# Altium schematic sheet User Interface.SchDoc: DO NOT FILL THIS IN
size Tabloid; Date: DO NOT FILL THIS IN; ApprovedBy: DO NOT FILL THIS IN; CheckedBy: DO NOT FILL THIS IN; Author: DO NOT FILL THIS IN; CompanyName: DO NOT FILL THIS IN; DrawnBy: DO NOT FILL THIS IN; Engineer: DO NOT FILL THIS IN; Organization: DO NOT FILL THIS IN; Address1: DO NOT FILL THIS IN; Address2: DO NOT FILL THIS IN; Address3: DO NOT FILL THIS IN; Address4: DO NOT FILL THIS IN; DocumentNumber: DO NOT FILL THIS IN; Revision: DO NOT FILL THIS IN; SheetNumber: 2; SheetTotal: 9; PageSetup: Record=PageOptions|CenterHorizontal=True|CenterVertical=True|PrintScale=1.00|XCorrection=1.00|YCorrection=1.00|PrintKind=1|BorderSize=5000000|LeftOffset=0|BottomOffset=0|Orientation=2|PaperLength=1000|PaperWidth=1000|Scale=100|PaperSource=7|PrintQuality=-4|MediaType=1|DitherType=10|PaperKind=Ledger|PrintScaleMode=1; cpr-ItemNumber: 025619; cpr-ItemName1: TurtleBot4 UI board; cpr-ItemName2: Rev 2; cpr-Revision: 2; cpr-SheetNumber: 2; cpr-SheetTotal: 10; cpr-Draft: AG; cpr-DraftDate: 19/04/2022; Time: DO NOT FILL THIS IN; ImagePath: DO NOT FILL THIS IN; Application_BuildNumber: DO NOT FILL THIS IN
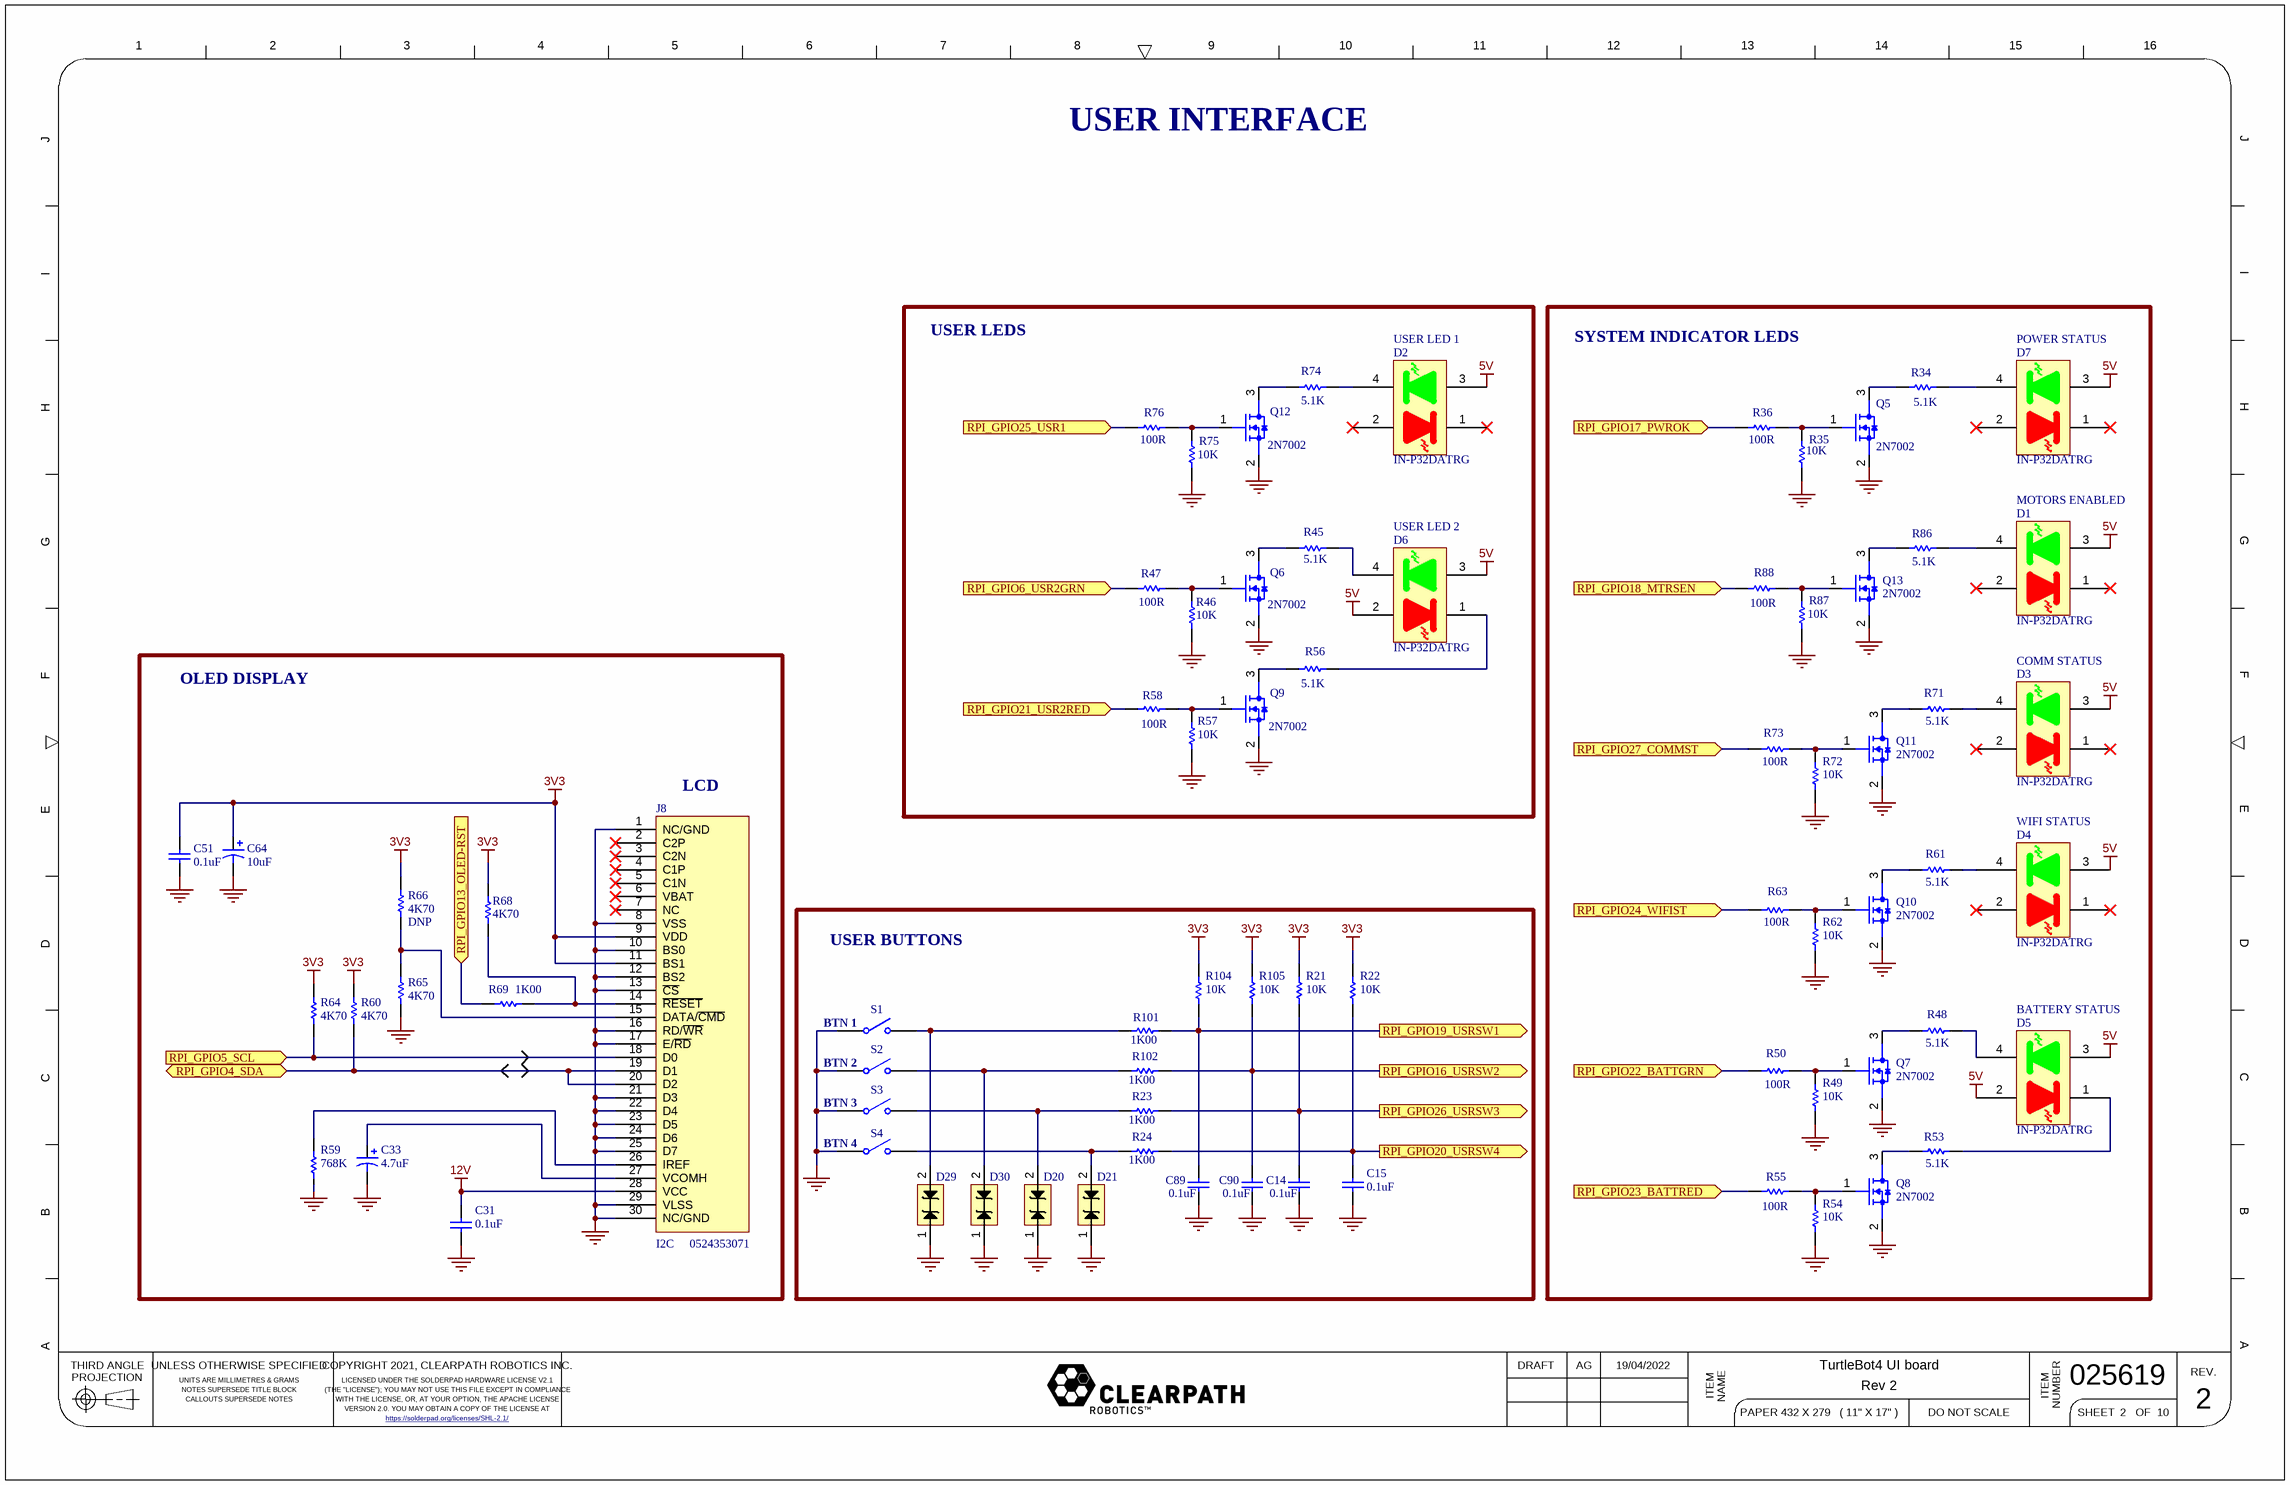
[diagram p0: User Interface.SchDoc]

## Parts
C14  value 0.1uF  [C0805]  (hidden comment: Capacitor _SMT)
C15  value 0.1uF  [C0805]  (hidden comment: Capacitor _SMT)
C31  value 0.1uF  [C0805]  (hidden comment: Capacitor _SMT)
C33  value 4.7uF  [CAP_TANT_3216-18]  (hidden comment: Cap Pol1)
C51  value 0.1uF  [C0805]  (hidden comment: Capacitor _SMT)
C64  value 10uF  [CAP_TANT_3216-18]  (hidden comment: Cap Pol1)
C89  value 0.1uF  [C0805]  (hidden comment: Capacitor _SMT)
C90  value 0.1uF  [C0805]  (hidden comment: Capacitor _SMT)
D1  MOTORS ENABLED  [IN-P32DATRG]
D2  USER LED 1  [IN-P32DATRG]
D3  COMM STATUS  [IN-P32DATRG]
D4  WIFI STATUS  [IN-P32DATRG]
D5  BATTERY STATUS  [IN-P32DATRG]
D6  USER LED 2  [IN-P32DATRG]
D7  POWER STATUS  [IN-P32DATRG]
D20  TVS DIODE BIDIR 15V SMC  [DO-214AA]  (value not drawn)
D21  TVS DIODE BIDIR 15V SMC  [DO-214AA]  (value not drawn)
D29  TVS DIODE BIDIR 15V SMC  [DO-214AA]  (value not drawn)
D30  TVS DIODE BIDIR 15V SMC  [DO-214AA]  (value not drawn)
J8  Mfg PN: 0524353071  [MOLEX_0524353071_REV]  (hidden comment: 128x64 OLED)
Q5  Mfg PN: 2N7002  [SOT-23-3]  (hidden comment: NFET)
Q6  Mfg PN: 2N7002  [SOT-23-3]  (hidden comment: NFET)
Q7  Mfg PN: 2N7002  [SOT-23-3]  (hidden comment: NFET)
Q8  Mfg PN: 2N7002  [SOT-23-3]  (hidden comment: NFET)
Q9  Mfg PN: 2N7002  [SOT-23-3]  (hidden comment: NFET)
Q10  Mfg PN: 2N7002  [SOT-23-3]  (hidden comment: NFET)
Q11  Mfg PN: 2N7002  [SOT-23-3]  (hidden comment: NFET)
Q12  Mfg PN: 2N7002  [SOT-23-3]  (hidden comment: NFET)
Q13  Mfg PN: 2N7002  [SOT-23-3]  (hidden comment: NFET)
R21  value 10K  [R0805]  (hidden comment: Resistor_SMT)
R22  value 10K  [R0805]  (hidden comment: Resistor_SMT)
R23  value 1K00  [R0805]  (hidden comment: Resistor_SMT)
R24  value 1K00  [R0805]  (hidden comment: Resistor_SMT)
R34  value 5.1K  [R0805]  (hidden comment: Resistor_SMT)
R35  value 10K  [R0805]  (hidden comment: Resistor_SMT)
R36  value 100R  [R0805]  (hidden comment: Resistor_SMT)
R45  value 5.1K  [R0805]  (hidden comment: Resistor_SMT)
R46  value 10K  [R0805]  (hidden comment: Resistor_SMT)
R47  value 100R  [R0805]  (hidden comment: Resistor_SMT)
R48  value 5.1K  [R0805]  (hidden comment: Resistor_SMT)
R49  value 10K  [R0805]  (hidden comment: Resistor_SMT)
R50  value 100R  [R0805]  (hidden comment: Resistor_SMT)
R53  value 5.1K  [R0805]  (hidden comment: Resistor_SMT)
R54  value 10K  [R0805]  (hidden comment: Resistor_SMT)
R55  value 100R  [R0805]  (hidden comment: Resistor_SMT)
R56  value 5.1K  [R0805]  (hidden comment: Resistor_SMT)
R57  value 10K  [R0805]  (hidden comment: Resistor_SMT)
R58  value 100R  [R0805]  (hidden comment: Resistor_SMT)
R59  value 768K  [R0805]  (hidden comment: Resistor_SMT)
R60  value 4K70  [R0805]  (hidden comment: Resistor_SMT)
R61  value 5.1K  [R0805]  (hidden comment: Resistor_SMT)
R62  value 10K  [R0805]  (hidden comment: Resistor_SMT)
R63  value 100R  [R0805]  (hidden comment: Resistor_SMT)
R64  value 4K70  [R0805]  (hidden comment: Resistor_SMT)
R65  value 4K70  [R0805]  (hidden comment: Resistor_SMT)
R66  value 4K70  [R0805]  (hidden comment: Resistor_SMT)
R68  value 4K70  [R0805]  (hidden comment: Resistor_SMT)
R69  value 1K00  [R0805]  (hidden comment: Resistor_SMT)
R71  value 5.1K  [R0805]  (hidden comment: Resistor_SMT)
R72  value 10K  [R0805]  (hidden comment: Resistor_SMT)
R73  value 100R  [R0805]  (hidden comment: Resistor_SMT)
R74  value 5.1K  [R0805]  (hidden comment: Resistor_SMT)
R75  value 10K  [R0805]  (hidden comment: Resistor_SMT)
R76  value 100R  [R0805]  (hidden comment: Resistor_SMT)
R86  value 5.1K  [R0805]  (hidden comment: Resistor_SMT)
R87  value 10K  [R0805]  (hidden comment: Resistor_SMT)
R88  value 100R  [R0805]  (hidden comment: Resistor_SMT)
R101  value 1K00  [R0805]  (hidden comment: Resistor_SMT)
R102  value 1K00  [R0805]  (hidden comment: Resistor_SMT)
R104  value 10K  [R0805]  (hidden comment: Resistor_SMT)
R105  value 10K  [R0805]  (hidden comment: Resistor_SMT)
S1  SW-SPST  [PANA_EVP-ASKC1A]  (value not drawn)
S2  SW-SPST  [PANA_EVP-ASKC1A]  (value not drawn)
S3  SW-SPST  [PANA_EVP-ASKC1A]  (value not drawn)
S4  SW-SPST  [PANA_EVP-ASKC1A]  (value not drawn)

## Blocks framed on the sheet
USER LEDS: D2 D6 Q6 Q9 Q12 R45-R47 R56-R58 R74-R76
SYSTEM INDICATOR LEDS: D1 D3-D5 D7 Q5 Q7 Q8 Q10 Q11 Q13 R34-R36 R48-R50 R53-R55 R61-R63 R71-R73 R86-R88
USER BUTTONS: C14 C15 C89 C90 D20 D21 D29 D30 R21-R24 R101 R102 R104 R105 S1-S4

## Ports
RPI_GPIO4_SDA (bidir), RPI_GPIO5_SCL (in), RPI_GPIO6_USR2GRN (in), RPI_GPIO13_OLED-RST (in), RPI_GPIO16_USRSW2 (out), RPI_GPIO17_PWROK (in), RPI_GPIO18_MTRSEN (in), RPI_GPIO19_USRSW1 (out), RPI_GPIO20_USRSW4 (out), RPI_GPIO21_USR2RED (in), RPI_GPIO22_BATTGRN (in), RPI_GPIO23_BATTRED (in), RPI_GPIO24_WIFIST (in), RPI_GPIO25_USR1 (in), RPI_GPIO26_USRSW3 (out), RPI_GPIO27_COMMST (in)

## Nets
3V3: C51.2 C64.1 J8.9(VDD) J8.11(BS1) R21.1 R22.1 R60.1 R64.1 R66.1 R68.1 R104.1 R105.1
5V: D1.3(GA) D2.3(GA) D3.3(GA) D4.3(GA) D5.2(RA) D5.3(GA) D6.2(RA) D6.3(GA) D7.3(GA)
12V: C31.2 J8.28(VCC)
GND: C14.1 C15.1 C31.1 C33.2 C51.1 C64.2 C89.1 C90.1 D20.1 D21.1 D29.1 D30.1 J8.1(NC/GND) J8.8(VSS) J8.10(BS0) J8.12(BS2) J8.13(~{CS}) J8.16(RD/~{WR}) J8.17(E/~{RD}) J8.21(D3) J8.22(D4) J8.23(D5) J8.24(D6) J8.25(D7) J8.29(VLSS) J8.30(NC/GND) Q5.2(D1) Q6.2(D1) Q7.2(D1) Q8.2(D1) Q9.2(D1) Q10.2(D1) Q11.2(D1) Q12.2(D1) Q13.2(D1) R35.2 R46.2 R49.2 R54.2 R57.2 R59.2 R62.2 R65.2 R72.2 R75.2 R87.2 S1.1(COMMON) S2.1(COMMON) S3.1(COMMON) S4.1(COMMON)
RPI_GPIO4_SDA: J8.19(D1) J8.20(D2) R60.2 ; port RPI_GPIO4_SDA
RPI_GPIO5_SCL: J8.18(D0) R64.2 ; port RPI_GPIO5_SCL
RPI_GPIO6_USR2GRN: R47.2 ; port RPI_GPIO6_USR2GRN
RPI_GPIO13_OLED-RST: R69.1 ; port RPI_GPIO13_OLED-RST
RPI_GPIO16_USRSW2: C90.2 R102.1 R105.2 ; port RPI_GPIO16_USRSW2
RPI_GPIO17_PWROK: R36.2 ; port RPI_GPIO17_PWROK
RPI_GPIO18_MTRSEN: R88.2 ; port RPI_GPIO18_MTRSEN
RPI_GPIO19_USRSW1: C89.2 R101.1 R104.2 ; port RPI_GPIO19_USRSW1
RPI_GPIO20_USRSW4: C15.2 R22.2 R24.1 ; port RPI_GPIO20_USRSW4
RPI_GPIO21_USR2RED: R58.2 ; port RPI_GPIO21_USR2RED
RPI_GPIO22_BATTGRN: R50.2 ; port RPI_GPIO22_BATTGRN
RPI_GPIO23_BATTRED: R55.2 ; port RPI_GPIO23_BATTRED
RPI_GPIO24_WIFIST: R63.2 ; port RPI_GPIO24_WIFIST
RPI_GPIO25_USR1: R76.2 ; port RPI_GPIO25_USR1
RPI_GPIO26_USRSW3: C14.2 R21.2 R23.1 ; port RPI_GPIO26_USRSW3
RPI_GPIO27_COMMST: R73.2 ; port RPI_GPIO27_COMMST
NetC33_1: C33.1 J8.27(VCOMH)
NetD1_4: D1.4(GK) R86.1
NetD2_4: D2.4(GK) R74.1
NetD3_4: D3.4(GK) R71.1
NetD4_4: D4.4(GK) R61.1
NetD5_1: D5.1(RK) R53.1
NetD5_4: D5.4(GK) R48.1
NetD6_1: D6.1(RK) R56.1
NetD6_4: D6.4(GK) R45.1
NetD7_4: D7.4(GK) R34.1
NetD20_2: D20.2 R23.2 S3.2(NO)
NetD21_2: D21.2 R24.2 S4.2(NO)
NetD29_2: D29.2 R101.2 S1.2(NO)
NetD30_2: D30.2 R102.2 S2.2(NO)
NetJ8_14: J8.14(~{RESET}) R68.2 R69.2
NetJ8_15: J8.15(DATA/~{CMD}) R65.1 R66.2
NetJ8_26: J8.26(IREF) R59.1
NetQ5_1: Q5.1(G1) R35.1 R36.1
NetQ5_3: Q5.3(S1) R34.2
NetQ6_1: Q6.1(G1) R46.1 R47.1
NetQ6_3: Q6.3(S1) R45.2
NetQ7_1: Q7.1(G1) R49.1 R50.1
NetQ7_3: Q7.3(S1) R48.2
NetQ8_1: Q8.1(G1) R54.1 R55.1
NetQ8_3: Q8.3(S1) R53.2
NetQ9_1: Q9.1(G1) R57.1 R58.1
NetQ9_3: Q9.3(S1) R56.2
NetQ10_1: Q10.1(G1) R62.1 R63.1
NetQ10_3: Q10.3(S1) R61.2
NetQ11_1: Q11.1(G1) R72.1 R73.1
NetQ11_3: Q11.3(S1) R71.2
NetQ12_1: Q12.1(G1) R75.1 R76.1
NetQ12_3: Q12.3(S1) R74.2
NetQ13_1: Q13.1(G1) R87.1 R88.1
NetQ13_3: Q13.3(S1) R86.2

Not connected (* = marked no-connect by the designer): D1 1(RK)* 2(RA)*; D2 1(RK)* 2(RA)*; D3 1(RK)* 2(RA)*; D4 1(RK)* 2(RA)*; D7 1(RK)* 2(RA)*; J8 2(C2P)* 3(C2N)* 4(C1P)* 5(C1N)* 6(VBAT)* 7(NC)*

## Notes on the sheet
- USER INTERFACE
- OLED DISPLAY
- (near J8) LCD
- (near S1) BTN 1
- (near S2) BTN 2
- (near S3) BTN 3
- (near S4) BTN 4
- (near J8) I2C
- 1
- 2
- 3
- 4
- 5
- 6
- 7
- 8
- 9
- 10
- 11
- 12
- 13
- 14
- 15
- 16
- J
- I
- H
- G
- F
- E
- D
- C
- B
- A
- THIRD ANGLE
- PROJECTION
- UNLESS OTHERWISE SPECIFIED
- COPYRIGHT 2021, CLEARPATH ROBOTICS INC.
- DRAFT
- REV.
- UNITS ARE MILLIMETRES & GRAMS
- NOTES SUPERSEDE TITLE BLOCK
- CALLOUTS SUPERSEDE NOTES
- LICENSED UNDER THE SOLDERPAD HARDWARE LICENSE V2.1
- (THE "LICENSE"); YOU MAY NOT USE THIS FILE EXCEPT IN COMPLIANCE
- WITH THE LICENSE, OR, AT YOUR OPTION, THE APACHE LICENSE
- VERSION 2.0. YOU MAY OBTAIN A COPY OF THE LICENSE AT
- https://solderpad.org/licenses/SHL-2.1/ <https://solderpad.https://solderpad.org/licenses/SHL-2.1/org/licenses/SHL-2.1/>
- ITEM
- NAME
- PAPER 432 X 279   ( 11" X 17" )
- DO NOT SCALE
- NUMBER
- SHEET
- OF

## Library data of the parts
C14 C31 C89 C90 = Capacitor _SMT: Capacitor; Tolerance: 10%; Voltage: 50V; Vendor: Digikey; Vendor PN: 311-1140-1-ND; Mfg: Yageo; Mfg PN: CC0805KRX7R9BB104; DNP: *; Package: 0805
C15 C51 = Capacitor _SMT: Capacitor; Tolerance: 10%; Voltage: 25V; Vendor: Digikey; Vendor PN: 311-1140-1-ND; Mfg: Yageo; Mfg PN: CC0805KRX7R9BB104; DNP: *; Package: 0805
C33 = Cap Pol1: Polarized Capacitor (Radial); Vendor: Digikey; Mfg PN: TAJA475M025RNJ; Vendor PN: 478-8885-1-ND; Voltage: 25V; Tolerance: 10%; Mfg: Kemet; Package: 1206
C64 = Cap Pol1: Polarized Capacitor (Radial); Vendor: Digikey; Mfg PN: T494A106K010AT; Vendor PN: 399-8431-1-ND; Voltage: 10V; Tolerance: 10%; Mfg: Kemet; Package: 1206
D1-D7 = INOLUX IN_P32DATRG LED: Dual Colour LED 3528; Vendor: Digikey; Vendor PN: 1830-1115-1-ND; Mfg: Inolux; Mfg PN: IN-P32DATRG
D20 D21 D29 D30 = TVS DIODE BIDIR 15V SMC: TVS 600W 15V BI-DIR DO-214AA; Vendor: Digikey; Vendor PN: 18-SMA6J5.0CACT-ND; Mfg: Littelfuse Inc.; Mfg PN: SMA6J5.0CA; Package: DO214AC; Supplier 1: Digi-Key; Supplier Part Number 1: 18-SMA6J5.0CACT-ND
J8 = ER-OLED013-1: 128x64 OLED module; Manufacturer: Molex; Vendor PN: WM7976CT-ND; Vendor: Digikey
Q5-Q13 = NFET_SNGL: Vendor: Digikey; Vendor PN: 2N7002NCT-ND; Mfg: ON Semi; Package: SOT23-3
R21 R22 R35 R46 R49 R54 R57 R62 R72 R75 R87 R104 R105 = Resistor_SMT: Resistor; Vendor: Digikey; Vendor PN: 311-10.0KCRCT-ND; Tolerance: 1%; Mfg: Yageo; Mfg PN: RC0805FR-0710KL; Power Rating: *; Package: 0805
R23 R24 R69 R101 R102 = Resistor_SMT: Resistor; Vendor: Digikey; Vendor PN: 311-1.00KCRCT-ND; Tolerance: 1%; Mfg: Yageo; Mfg PN: RC0805FR-071KL; Power Rating: *; Package: 0805
R34 = Resistor_SMT: Resistor; Vendor: Digikey; Tolerance: 1%; Mfg PN: RC0805FR-07768RL; Power Rating: *; Package: 0805; Supplier 1: Digi-Key; Supplier Part Number 1: 311-768CRCT-ND
R36 R47 R50 R55 R58 R63 R73 R76 R88 = Resistor_SMT: Resistor; Vendor: Digikey; Vendor PN: 311-100CRCT-ND; Tolerance: 1%; Mfg: Yageo; Mfg PN: RC0805FR-07100RL; Power Rating: *; Package: 0805
R45 = Resistor_SMT: Resistor; Vendor: Digikey; Vendor PN: 311-82.0CRCT-ND; Tolerance: 1%; Mfg: Yageo; Mfg PN: RC0805FR-07768RL; Power Rating: *; Package: 0805; Supplier 1: Digi-Key; Supplier Part Number 1: 311-768CRCT-ND
R48 R61 R71 R74 = Resistor_SMT: Resistor; Vendor: Digikey; Tolerance: 1%; Mfg: Yageo; Mfg PN: RC0805FR-07768RL; Power Rating: *; Package: 0805; Supplier 1: Digi-Key; Supplier Part Number 1: 311-768CRCT-ND
R53 R56 = Resistor_SMT: Resistor; Vendor: Digikey; Tolerance: 1%; Mfg: Yageo; Mfg PN: RC0805FR-071KL; Power Rating: *; Package: 0805; Supplier 1: Digi-Key; Supplier Part Number 1: 311-1.00KCRTR-ND
R59 = Resistor_SMT: Resistor; Vendor: Digikey; Vendor PN: 311-768KCRCT-ND; Tolerance: 1%; Mfg: Yageo; Mfg PN: RC0805FR-07768KL; Power Rating: *; Package: 0805
R60 R64-R66 R68 = Resistor_SMT: Resistor; Vendor: Digikey; Vendor PN: 13-RC0805FR-104K7LCT-ND; Tolerance: 1%; Mfg: Yageo; Mfg PN: RC0805FR-104K7L; Power Rating: *; Package: 0805
  R66: DNP: DNP
R86 = Resistor_SMT: Resistor; Vendor: Digikey; Tolerance: 1%; Mfg: Yageo; Mfg PN: RC0805FR-0782RL; Power Rating: *; Package: 0805; Supplier 1: Digi-Key; Supplier Part Number 1: 311-768CRCT-ND
S1-S4 = SW-SPST: Single-Pole, Single-Throw Switch; Vendor: Digikey; Vendor PN: P124212CT-ND; Mfg PN: EVP-ASKC1A; Mfg: Panasonic